# EAGLE design Radio2_Aff (EAGLE 7.5.0)
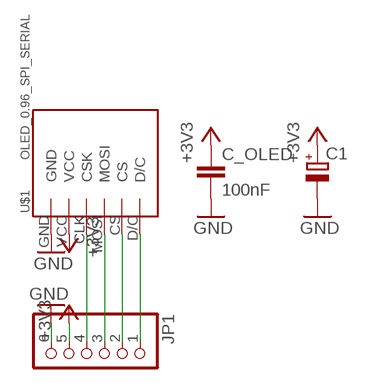
[diagram p0: schematic, sheet 1]

## Parts
C1  CPOL-EUE2-5  [E2-5]
C_OLED  100nF  C-EU025-024X044  [C025-024X044]
JP1  PINHD-1X6  [1X06]
U$1  OLED_0.96_SPI_SERIAL  [OLED_9.96_SPI_SERIAL]

## Nets
+3V3: C1.+ C_OLED.1 JP1.5 U$1.VCC
GND: C1.- C_OLED.2 JP1.6 U$1.GND
N$1: JP1.1 U$1.D/C
N$2: JP1.2 U$1.CS
N$3: JP1.3 U$1.MOSI
N$4: JP1.4 U$1.CLK(CSK)

## Library data of the parts
C1 = rcl:CPOL-EU: POLARIZED CAPACITOR, European symbol
C_OLED = rcl:C-EU: CAPACITOR, European symbol
JP1 = pinhead:PINHD-1X6: PIN HEADER
U$1 = tft_1.8_1.44_oled_0.96:OLED_0.96_SPI_SERIAL

## Board
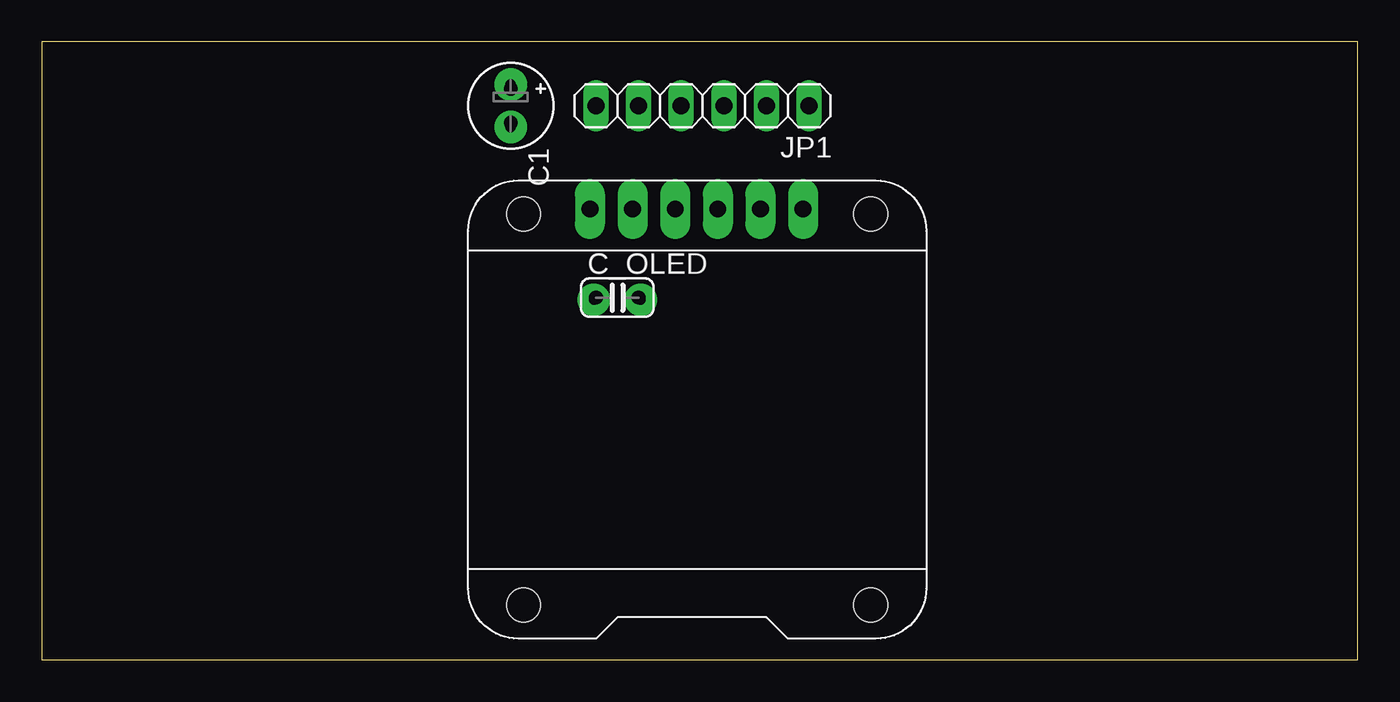
[diagram p1: board, top side]
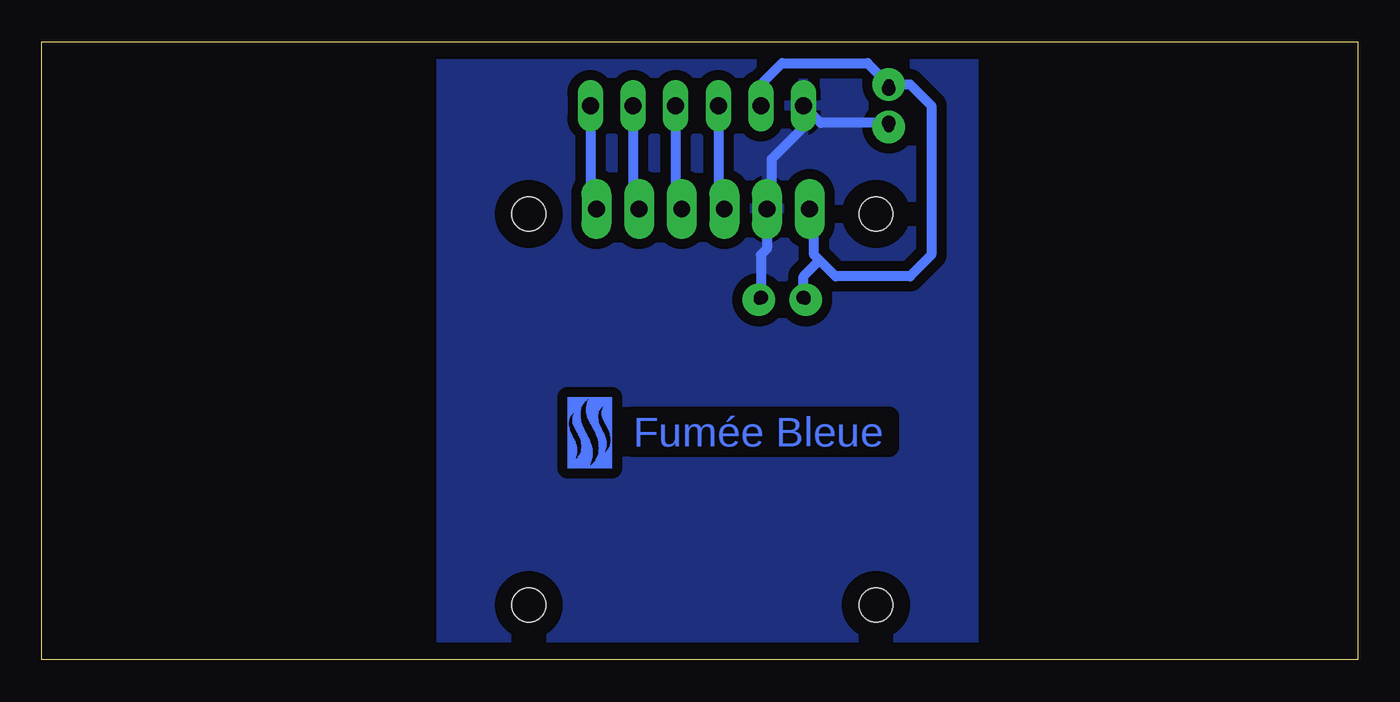
[diagram p2: board, bottom side, seen from below]

Size 78.41 x 36.82 mm. Coordinates in mm from the lower left corner, seen from the top.
Outline: 0,0 78.41,0 78.41,36.82 0,36.82 0,0
Copper layers (1*16): Top 0.035mm / dielectric 1.5mm / Bottom 0.035mm
Design rules "default": minimum track width 10mil, minimum drill 24mil, track to track 8mil, track to pad 8mil, pad to pad 8mil, via to via 8mil, smd to smd 8mil, copper to edge 40mil, drill to drill 8mil, minimum pad ring 10mil, minimum via ring 8mil, stop-mask expansion 4mil, vias tented up to drill 0mil, thermal gap 10mil

### Footprints (pad centres in the part's own frame; a part is rotated, then mirrored left to right if it is on the bottom)
E2-5 = drill 0.813 pad 1.27: + -1.016,0 | drill 0.813 pad 1.27 octagon: - 1.016,0
C025-024X044 = drill 0.813 octagon: 1 -1.27,0; 2 1.27,0
1X06 = drill 1.016 long: 1 -6.35,0; 2 -3.81,0; 3 -1.27,0; 4 1.27,0; 5 3.81,0; 6 6.35,0
OLED_9.96_SPI_SERIAL = drill 1 pad 1.778 long: CLK -1.63,11.63; CS 3.45,11.63; D/C 5.99,11.63; GND -4.17,11.63; MOSI 0.91,11.63; VCC -6.71,11.63 | hole 2: -10.67,-11.97; 10.03,-11.97; 10.03,11.33; -10.67,11.33

### Placement (x,y rotation side)
C1  27.94,33.02 270 top
C_OLED  34.29,21.59 0 top
JP1  39.37,33.02 180 top
U$1  39.37,15.24 0 top
U$2  [FB]  44.45,11.43 0 top

### Tracks (layer width: path | path; a pad name or v marks a point on that pad's centre or on a via)
+3V3  (via drill 0.6 pad 1.93)
  Bottom 0.61: C1.+ v27.94,34.29 | JP1.5 35.56,34.29 34.29,35.56 29.21,35.56 v27.94,34.29 | v27.94,34.29 26.67,34.29 25.4,33.02 25.4,24.13 26.67,22.86 31.12,22.86 32.07,23.81 | 32.07,23.81 32.38,24.13 32.38,26.59 U$1.VCC | C_OLED.1 33.02,22.86 32.07,23.81
GND
  Bottom 0.61: C1.- 32,32 JP1.6 33.02,31.75 34.92,29.84 34.92,27.14 U$1.GND 35.2,24.49 35.56,24.13 C_OLED.2
  pour Bottom (isolate 0.61): 22.86,36.83 54.61,36.83 54.61,0 22.86,0
N$1
  Bottom 0.61: JP1.1 45.72,27.23 U$1.D/C
N$2
  Bottom 0.61: JP1.2 43.18,27.23 U$1.CS
N$3
  Bottom 0.61: JP1.3 40.64,27.23 U$1.MOSI
N$4
  Bottom 0.61: JP1.4 38.1,27.23 U$1.CLK
N$5  (via drill 0.6 pad 1.93)
  other vias: 27.94,31.75
N$6  (via drill 0.6 pad 1.93)
  other vias: 32.89,21.46
N$7  (via drill 0.6 pad 1.93)
  other vias: 35.69,21.46

### Text on the board
Bottom: Fumée Bleue